# Altium schematic sheet Connection.SchDoc
size A4; DocumentNumber: 1; SheetNumber: 2; SheetTotal: 5
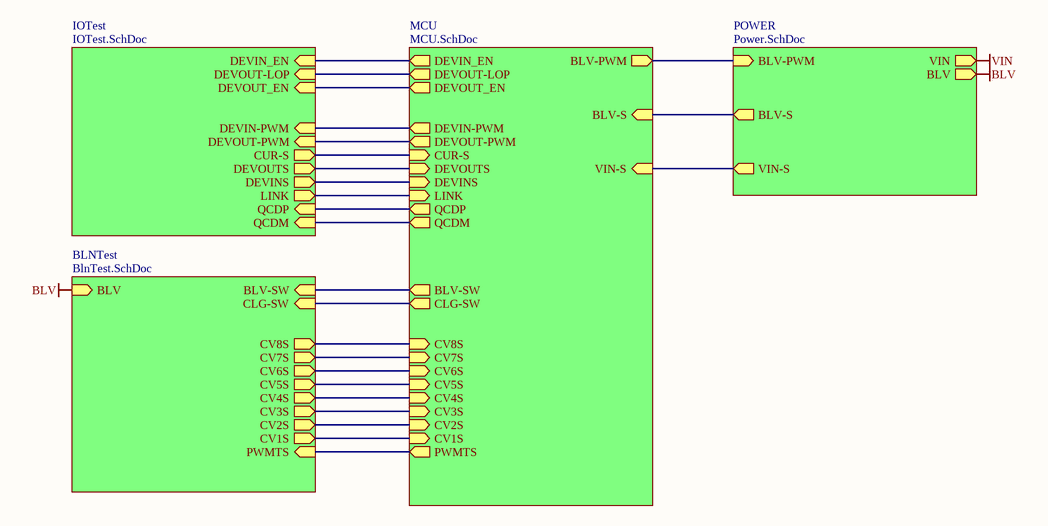
[diagram p0: Connection.SchDoc]

## Sub-sheets
BLNTest = BlnTest.SchDoc: BLV-SW (in), BLV (in), CLG-SW (in), CV5S (out), CV6S (out), CV7S (out), CV8S (out), CV3S (out), CV4S (out), CV2S (out), CV1S (out), PWMTS (in)
IOTest = IOTest.SchDoc: DEVINS (out), DEVOUTS (out), CUR-S (out), DEVOUT-LOP (in), DEVIN_EN (in), LINK (out), QCDP (in), QCDM (in), DEVOUT_EN (in), DEVIN-PWM (in), DEVOUT-PWM (in)
MCU = MCU.SchDoc: CV5S (in), CV6S (in), CV1S (in), CV7S (in), CV8S (in), CV3S (in), CV4S (in), CV2S (in), DEVOUTS (in), CUR-S (in), DEVINS (in), BLV-S (in), CLG-SW (out), BLV-SW (out), DEVOUT-LOP (out), DEVIN_EN (out), BLV-PWM (out), LINK (in), PWMTS (out), QCDP (out), QCDM (out), VIN-S (in), DEVOUT_EN (out), DEVIN-PWM (out), DEVOUT-PWM (out)
POWER = Power.SchDoc: BLV-PWM (in), BLV (out), BLV-S (out), VIN (out), VIN-S (out)

## Nets
BLV: sheet POWER/BLV, sheet BLNTest/BLV
VIN: sheet POWER/VIN
(unnamed): sheet IOTest/DEVINS, sheet MCU/DEVINS
(unnamed): sheet IOTest/DEVOUTS, sheet MCU/DEVOUTS
(unnamed): sheet IOTest/CUR-S, sheet MCU/CUR-S
(unnamed): sheet IOTest/DEVOUT-LOP, sheet MCU/DEVOUT-LOP
(unnamed): sheet IOTest/DEVIN_EN, sheet MCU/DEVIN_EN
(unnamed): sheet IOTest/LINK, sheet MCU/LINK
(unnamed): sheet IOTest/QCDP, sheet MCU/QCDP
(unnamed): sheet IOTest/QCDM, sheet MCU/QCDM
(unnamed): sheet IOTest/DEVOUT_EN, sheet MCU/DEVOUT_EN
(unnamed): sheet IOTest/DEVIN-PWM, sheet MCU/DEVIN-PWM
(unnamed): sheet IOTest/DEVOUT-PWM, sheet MCU/DEVOUT-PWM
(unnamed): sheet MCU/CV5S, sheet BLNTest/CV5S
(unnamed): sheet MCU/CV6S, sheet BLNTest/CV6S
(unnamed): sheet MCU/CV1S, sheet BLNTest/CV1S
(unnamed): sheet MCU/CV7S, sheet BLNTest/CV7S
(unnamed): sheet MCU/CV8S, sheet BLNTest/CV8S
(unnamed): sheet MCU/CV3S, sheet BLNTest/CV3S
(unnamed): sheet MCU/CV4S, sheet BLNTest/CV4S
(unnamed): sheet MCU/CV2S, sheet BLNTest/CV2S
(unnamed): sheet MCU/BLV-S, sheet POWER/BLV-S
(unnamed): sheet MCU/CLG-SW, sheet BLNTest/CLG-SW
(unnamed): sheet MCU/BLV-SW, sheet BLNTest/BLV-SW
(unnamed): sheet MCU/BLV-PWM, sheet POWER/BLV-PWM
(unnamed): sheet MCU/PWMTS, sheet BLNTest/PWMTS
(unnamed): sheet MCU/VIN-S, sheet POWER/VIN-S